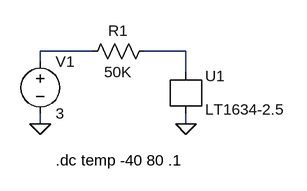
[diagram p0: schematic 1634-2.5.asc]
1634-2.5.asc, the LTspice schematic file:
Version 4
SHEET 1 880 680
WIRE 128 144 48 144
WIRE 272 144 208 144
WIRE 48 160 48 144
WIRE 272 176 272 144
WIRE 48 256 48 240
WIRE 272 256 272 240
FLAG 272 256 0
FLAG 48 256 0
SYMBOL References\\LT1634-2.5 272 208 R0
SYMATTR InstName U1
SYMBOL voltage 48 144 R0
SYMATTR InstName V1
SYMATTR Value 3
SYMBOL res 112 160 R270
WINDOW 0 32 56 VTop 2
WINDOW 3 0 56 VBottom 2
SYMATTR InstName R1
SYMATTR Value 50K
TEXT 72 312 Left 2 !.dc temp -40 80 .1

The netlist it stands for:
* 1634-2.5.asc
XU1 N002 0 LT1634-2.5
V1 N001 0 3
R1 N001 N002 50K
.dc temp -40 80 .1
.backanno
.end